# Altium schematic sheet FunctionalSchematic.SchDoc: DSP
size A3; Organization: Institut d'Automatisation Industrielle; SheetNumber: 2; SheetTotal: 3; SVN: OUI; CurrentTime: 6; CurrentDate: 5; DocumentFullPathAndName: 8; DocumentName: 9; ModifiedDate: 13; ProjectName: <projet>
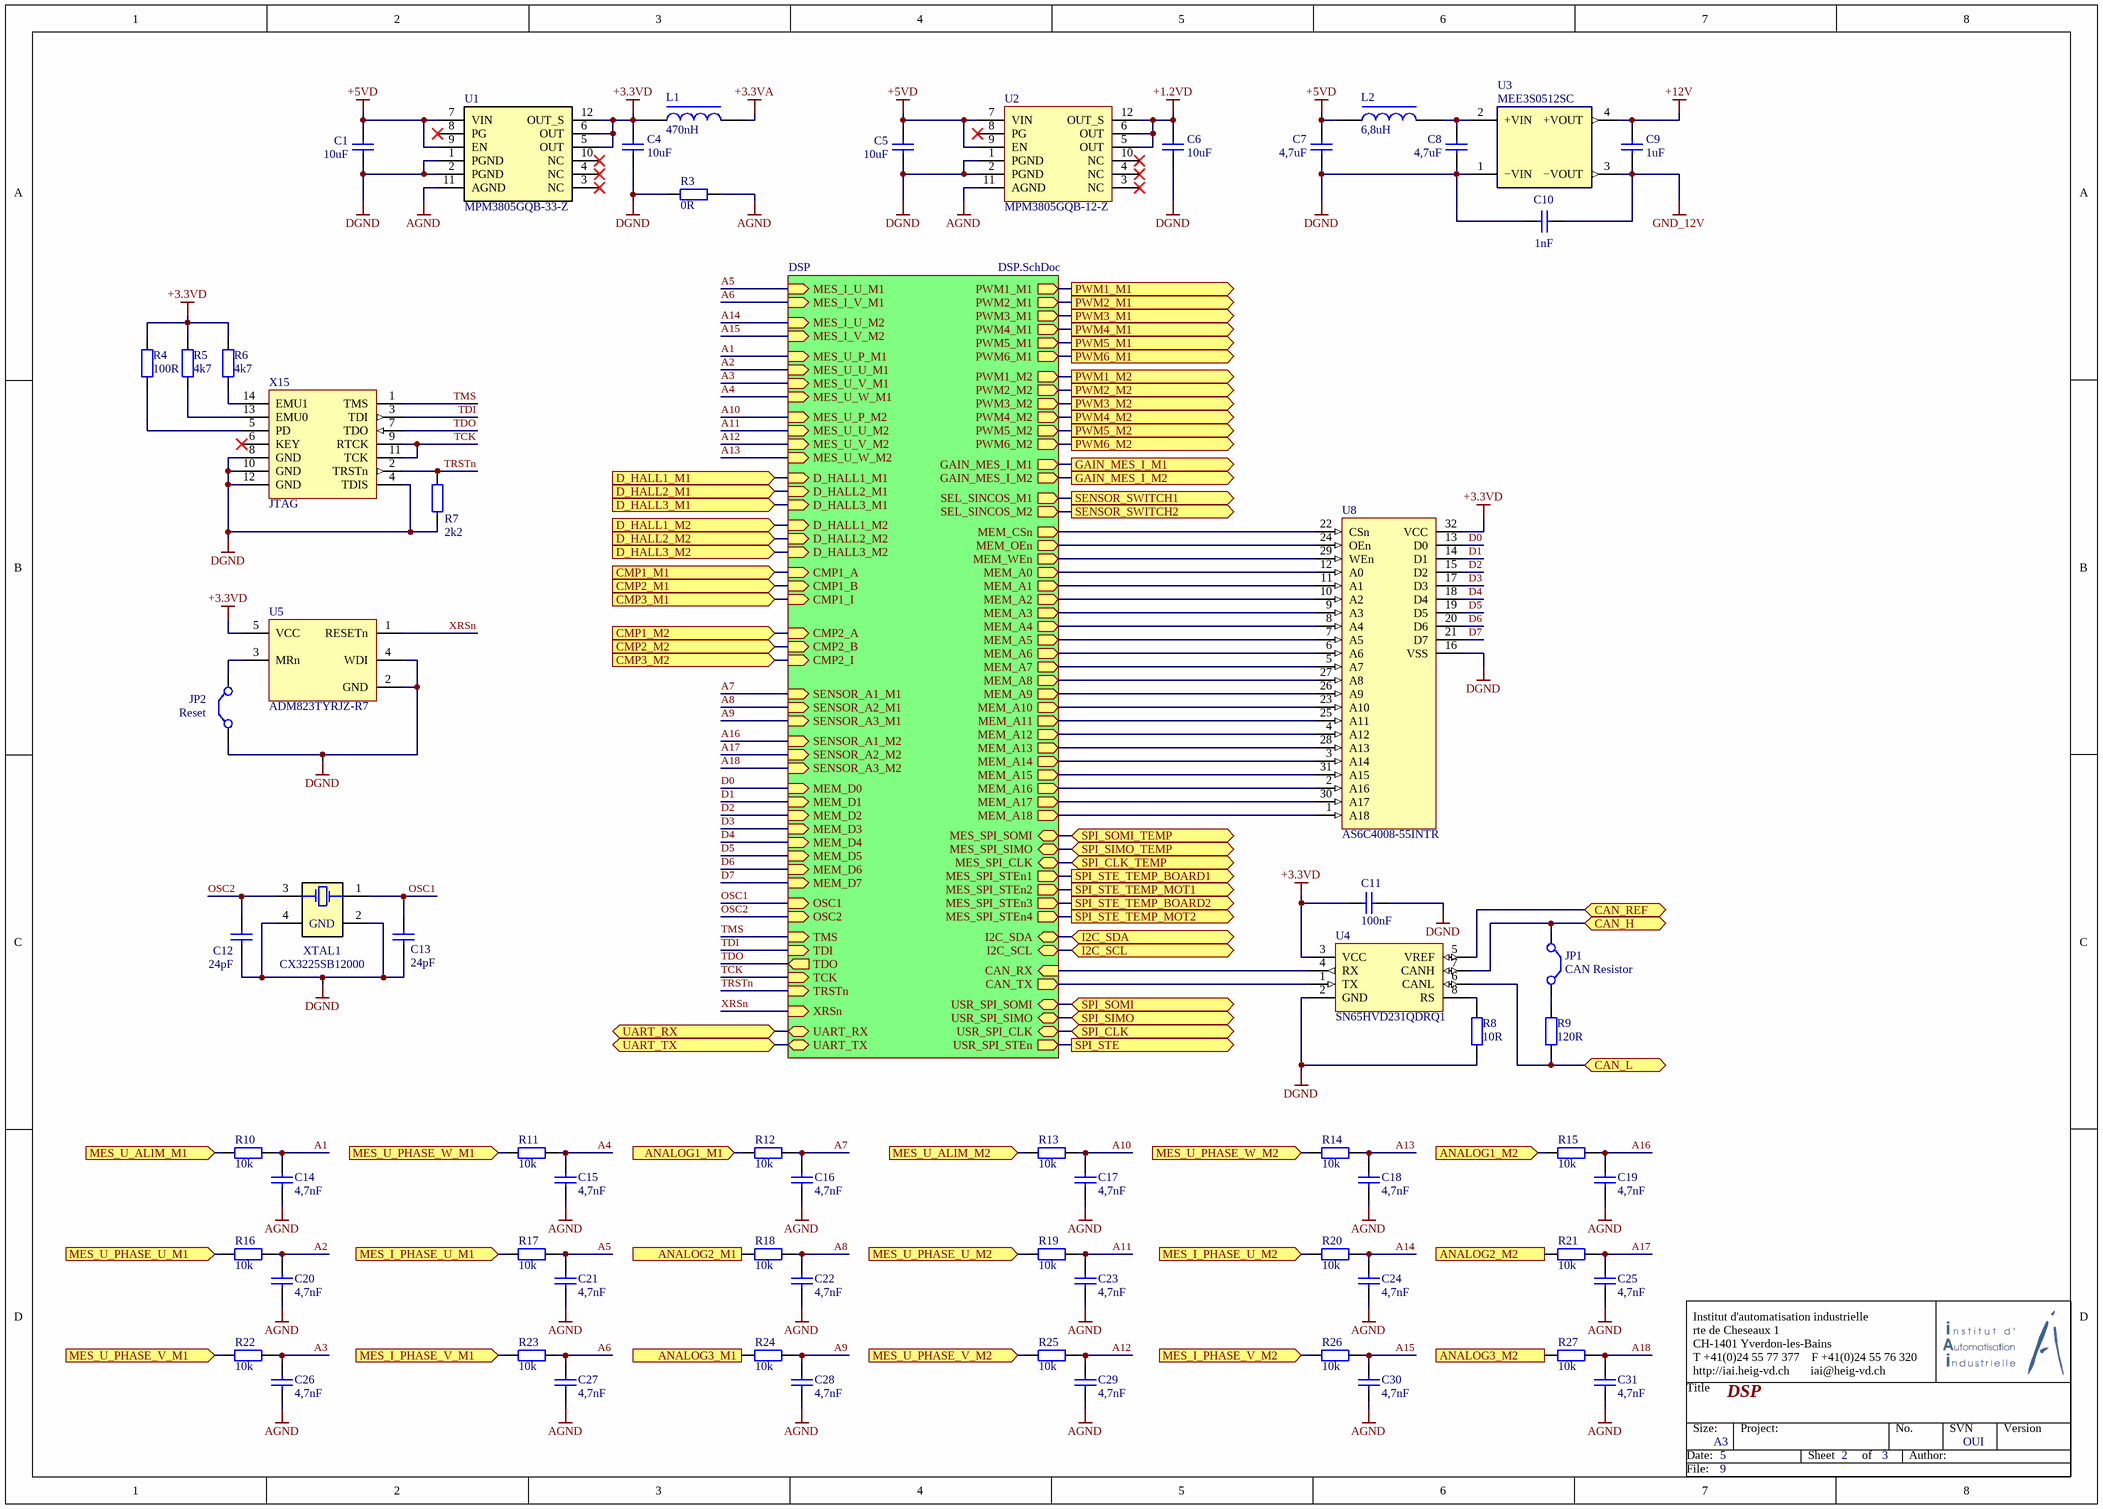
[diagram p0: FunctionalSchematic.SchDoc]

## Parts
C1  value 10uF  [CAPC1608X08N]  (hidden comment: CAP CER 10uF 0603)
C4  value 10uF  [CAPC1608X08N]  (hidden comment: CAP CER 10uF 0603)
C5  value 10uF  [CAPC1608X08N]  (hidden comment: CAP CER 10uF 0603)
C6  value 10uF  [CAPC1608X08N]  (hidden comment: CAP CER 10uF 0603)
C7  value 4,7uF  [CAPC1608X08N]  (hidden comment: CAP CER 4.7uF 0603)
C8  value 4,7uF  [CAPC1608X08N]  (hidden comment: CAP CER 4.7uF 0603)
C9  value 1uF  [CAPC1608X08N]  (hidden comment: CAP CER 1uF 0603)
C10  value 1nF  [CAPC1608X08N]  (hidden comment: CAP CER 1nF 0603)
C11  value 100nF  [CAPC1608X08N]  (hidden comment: CAP CER 100nF 0603)
C12  value 24pF  [CAPC1608X08N]  (hidden comment: CAP CER 1nF 0603)
C13  value 24pF  [CAPC1608X08N]  (hidden comment: CAP CER 1nF 0603)
C14  value 4,7nF  [CAPC1608X08N]  (hidden comment: CAP CER 4.7nF 0603)
C15  value 4,7nF  [CAPC1608X08N]  (hidden comment: CAP CER 4.7nF 0603)
C16  value 4,7nF  [CAPC1608X08N]  (hidden comment: CAP CER 4.7nF 0603)
C17  value 4,7nF  [CAPC1608X08N]  (hidden comment: CAP CER 4.7nF 0603)
C18  value 4,7nF  [CAPC1608X08N]  (hidden comment: CAP CER 4.7nF 0603)
C19  value 4,7nF  [CAPC1608X08N]  (hidden comment: CAP CER 4.7nF 0603)
C20  value 4,7nF  [CAPC1608X08N]  (hidden comment: CAP CER 4.7nF 0603)
C21  value 4,7nF  [CAPC1608X08N]  (hidden comment: CAP CER 4.7nF 0603)
C22  value 4,7nF  [CAPC1608X08N]  (hidden comment: CAP CER 4.7nF 0603)
C23  value 4,7nF  [CAPC1608X08N]  (hidden comment: CAP CER 4.7nF 0603)
C24  value 4,7nF  [CAPC1608X08N]  (hidden comment: CAP CER 4.7nF 0603)
C25  value 4,7nF  [CAPC1608X08N]  (hidden comment: CAP CER 4.7nF 0603)
C26  value 4,7nF  [CAPC1608X08N]  (hidden comment: CAP CER 4.7nF 0603)
C27  value 4,7nF  [CAPC1608X08N]  (hidden comment: CAP CER 4.7nF 0603)
C28  value 4,7nF  [CAPC1608X08N]  (hidden comment: CAP CER 4.7nF 0603)
C29  value 4,7nF  [CAPC1608X08N]  (hidden comment: CAP CER 4.7nF 0603)
C30  value 4,7nF  [CAPC1608X08N]  (hidden comment: CAP CER 4.7nF 0603)
C31  value 4,7nF  [CAPC1608X08N]  (hidden comment: CAP CER 4.7nF 0603)
JP1  Use: CAN Resistor  [62000211121]  (hidden comment: CONNECT 2pos 90°)
JP2  Use: Reset  [62000211121]  (hidden comment: CONNECT 2pos 90°)
L1  value 470nH  [INDC2016X10N]  (hidden comment: IND SMD 470nH 0806)
L2  value 6,8uH  [INDC1608X10N]  (hidden comment: IND SMD 0603)
R3  value 0R  [RESC1508X04N]  (hidden comment: RES SMD 0R 0603)
R4  value 100R  [RESC1508X04N]  (hidden comment: RES SMD 100R 0603)
R5  value 4k7  [RESC1508X04N]  (hidden comment: RES SMD 4.7k 0603)
R6  value 4k7  [RESC1508X04N]  (hidden comment: RES SMD 4.7k 0603)
R7  value 2k2  [RESC1508X04N]  (hidden comment: RES SMD 2K2 0603)
R8  value 10R  [RESC1508X04N]  (hidden comment: RES SMD 10R 0603)
R9  value 120R  [RESC1508X04N]  (hidden comment: RES SMD 120R 0603)
R10  value 10k  [RESC1508X04N]  (hidden comment: RES 10K SMD 0603)
R11  value 10k  [RESC1508X04N]  (hidden comment: RES 10K SMD 0603)
R12  value 10k  [RESC1508X04N]  (hidden comment: RES 10K SMD 0603)
R13  value 10k  [RESC1508X04N]  (hidden comment: RES 10K SMD 0603)
R14  value 10k  [RESC1508X04N]  (hidden comment: RES 10K SMD 0603)
R15  value 10k  [RESC1508X04N]  (hidden comment: RES 10K SMD 0603)
R16  value 10k  [RESC1508X04N]  (hidden comment: RES 10K SMD 0603)
R17  value 10k  [RESC1508X04N]  (hidden comment: RES 10K SMD 0603)
R18  value 10k  [RESC1508X04N]  (hidden comment: RES 10K SMD 0603)
R19  value 10k  [RESC1508X04N]  (hidden comment: RES 10K SMD 0603)
R20  value 10k  [RESC1508X04N]  (hidden comment: RES 10K SMD 0603)
R21  value 10k  [RESC1508X04N]  (hidden comment: RES 10K SMD 0603)
R22  value 10k  [RESC1508X04N]  (hidden comment: RES 10K SMD 0603)
R23  value 10k  [RESC1508X04N]  (hidden comment: RES 10K SMD 0603)
R24  value 10k  [RESC1508X04N]  (hidden comment: RES 10K SMD 0603)
R25  value 10k  [RESC1508X04N]  (hidden comment: RES 10K SMD 0603)
R26  value 10k  [RESC1508X04N]  (hidden comment: RES 10K SMD 0603)
R27  value 10k  [RESC1508X04N]  (hidden comment: RES 10K SMD 0603)
U1  value MPM3805GQB-33-Z  [QFN2p5x3p0x0p9_MNP]  (hidden comment: DC DC CONVERTER 5V-3.3V)
U2  value MPM3805GQB-12-Z  [QFN2p5x3p0x0p9_MNP]  (hidden comment: DC DC CONVERTER 5V-1.2V)
U3  value MEE3S0512SC  [DCDC CONVERTER]  (hidden comment: DC DC CONVERTER 5V-12V)
U4  value SN65HVD231QDRQ1  [SOIC127P600X175-8N]  (hidden comment: IC TRANSCEIVER CAN)
U5  value ADM823TYRJZ-R7  [SOT95P280X145-5N]  (hidden comment: SUPERVISOR 1 CHANNEL)
U8  value AS6C4008-55INTR  [SOP127P1410X300-32N]  (hidden comment: RAM SPI)
X15  Use: JTAG  [62101421021]  (hidden comment: CONNECT SMD 7x2pos 180°)
XTAL1  value CX3225SB12000  [OSCCC320X250X60N]  (hidden comment: CRYSTAL 12.0000MHZ)

## Sub-sheets
DSP = DSP.SchDoc: MEM_A11 (out), MES_U_U_M2 (in), MEM_A18 (out), SEL_SINCOS_M2 (out), MES_U_P_M2 (in), MEM_D1 (in), SENSOR_A3_M1 (in), D_HALL3_M1 (in), D_HALL3_M2 (in), MES_SPI_STEn1 (out), SENSOR_A3_M2 (in), MES_SPI_STEn3 (out), MES_I_U_M2 (in), MEM_D0 (in), CMP1_I (in), MEM_D4 (in), CMP2_I (in), MES_SPI_STEn2 (out), CMP2_B (in), MEM_D5 (in), MEM_D6 (in), MES_SPI_STEn4 (out), MEM_A15 (out), CMP1_A (in), MES_I_V_M1 (in), MEM_D2 (in), OSC2 (in), TDI (in), SEL_SINCOS_M1 (out), MES_U_P_M1 (in), SENSOR_A2_M1 (in), XRSn (in), SENSOR_A1_M1 (in), SENSOR_A2_M2 (in), MEM_D7 (in), MES_U_V_M2 (in), D_HALL2_M2 (in), MEM_A16 (out), OSC1 (in), MES_I_V_M2 (in), MEM_A7 (out), MEM_A14 (out), MEM_D3 (in), MEM_A10 (out), MEM_A9 (out), TMS (in), MES_U_V_M1 (in), GAIN_MES_I_M1 (out), MEM_A12 (out), TRSTn (in), D_HALL1_M1 (in), MEM_A6 (out), MEM_A17 (out), CMP1_B (in), MES_U_W_M1 (in), SENSOR_A1_M2 (in), MES_U_U_M1 (in), D_HALL2_M1 (in), TCK (in), D_HALL1_M2 (in), MES_U_W_M2 (in), MEM_A13 (out), TDO (out), MES_I_U_M1 (in), MEM_CSn (out), MEM_A8 (out), CMP2_A (in), GAIN_MES_I_M2 (out), MEM_A2 (out), PWM5_M1 (out), MEM_A0 (out), PWM6_M1 (out), MEM_OEn (out), MES_SPI_CLK (bidir), USR_SPI_CLK (bidir), PWM2_M1 (out), PWM5_M2 (out), UART_TX (bidir), MES_SPI_SOMI (bidir), PWM6_M2 (out), PWM1_M2 (out), USR_SPI_SIMO (bidir), PWM3_M1 (out), I2C_SCL (bidir), USR_SPI_SOMI (bidir), MEM_A5 (out), PWM3_M2 (out), I2C_SDA (bidir), MEM_A4 (out), MEM_WEn (out), UART_RX (bidir), PWM4_M2 (out), CAN_RX (in), USR_SPI_STEn (out), CAN_TX (out), PWM4_M1 (out), PWM1_M1 (out), MES_SPI_SIMO (bidir), MEM_A3 (out), MEM_A1 (out), PWM2_M2 (out)

## Ports
ANALOG1_M1 (in), ANALOG1_M2 (in), ANALOG2_M1 (in), ANALOG2_M2 (in), ANALOG3_M1 (in), ANALOG3_M2 (in), CAN_H (bidir), CAN_L (bidir), CAN_REF (bidir), CMP1_M1 (in), CMP1_M2 (in), CMP2_M1 (in), CMP2_M2 (in), CMP3_M1 (in), CMP3_M2 (in), D_HALL1_M1 (in), D_HALL1_M2 (in), D_HALL2_M1 (in), D_HALL2_M2 (in), D_HALL3_M1 (in), D_HALL3_M2 (in), GAIN_MES_I_M1 (out), GAIN_MES_I_M2 (out), I2C_SCL (bidir), I2C_SDA (bidir), MES_I_PHASE_U_M1 (in), MES_I_PHASE_U_M2 (in), MES_I_PHASE_V_M1 (in), MES_I_PHASE_V_M2 (in), MES_U_ALIM_M1 (in), MES_U_ALIM_M2 (in), MES_U_PHASE_U_M1 (in), MES_U_PHASE_U_M2 (in), MES_U_PHASE_V_M1 (in), MES_U_PHASE_V_M2 (in), MES_U_PHASE_W_M1 (in), MES_U_PHASE_W_M2 (in), PWM1_M1 (out), PWM1_M2 (out), PWM2_M1 (out), PWM2_M2 (out), PWM3_M1 (out), PWM3_M2 (out), PWM4_M1 (out), PWM4_M2 (out), PWM5_M1 (out), PWM5_M2 (out), PWM6_M1 (out), PWM6_M2 (out), SENSOR_SWITCH1 (out), SENSOR_SWITCH2 (out), SPI_CLK (bidir), SPI_CLK_TEMP (bidir), SPI_SIMO (bidir), SPI_SIMO_TEMP (bidir), SPI_SOMI (bidir), SPI_SOMI_TEMP (bidir), SPI_STE (out), SPI_STE_TEMP_BOARD1 (out), SPI_STE_TEMP_BOARD2 (out), SPI_STE_TEMP_MOT1 (out), SPI_STE_TEMP_MOT2 (out), UART_RX (bidir), UART_TX (bidir)

## Nets
+1.2VD: C6.2 U2.5(OUT) U2.6(OUT) U2.12(OUT_S)
+3.3VA: L1.2
+3.3VD: C4.2 C11.1 L1.1 R4.2 R5.2 R6.2 U1.5(OUT) U1.6(OUT) U1.12(OUT_S) U4.3(VCC) U5.5(VCC) U8.32(VCC)
+5VD: C1.2 C5.2 C7.2 L2.1 U1.7(VIN) U1.9(EN) U2.7(VIN) U2.9(EN)
+12V: C9.2 U3.4(+VOUT)
AGND: C14.1 C15.1 C16.1 C17.1 C18.1 C19.1 C20.1 C21.1 C22.1 C23.1 C24.1 C25.1 C26.1 C27.1 C28.1 C29.1 C30.1 C31.1 R3.2 U1.11(AGND) U2.11(AGND)
DGND: C1.1 C4.1 C5.1 C6.1 C7.1 C8.1 C10.1 C11.2 C12.1 C13.2 JP2.2(C2) R3.1 R7.1 R8.1 U1.1(PGND) U1.2(PGND) U2.1(PGND) U2.2(PGND) U3.1(−VIN) U4.2(GND) U5.2(GND) U5.4(WDI) U8.16(VSS) X15.4(TDIS) X15.8(GND) X15.10(GND) X15.12(GND) XTAL1.2(GND) XTAL1.4(GND)
GND_12V: C9.1 C10.2 U3.3(−VOUT)
A1: C14.2 R10.2 ; sheet DSP/MES_U_P_M1
A2: C20.2 R16.2 ; sheet DSP/MES_U_U_M1
A3: C26.2 R22.2 ; sheet DSP/MES_U_V_M1
A4: C15.2 R11.2 ; sheet DSP/MES_U_W_M1
A5: C21.2 R17.2 ; sheet DSP/MES_I_U_M1
A6: C27.2 R23.2 ; sheet DSP/MES_I_V_M1
A7: C16.2 R12.2 ; sheet DSP/SENSOR_A1_M1
A8: C22.2 R18.2 ; sheet DSP/SENSOR_A2_M1
A9: C28.2 R24.2 ; sheet DSP/SENSOR_A3_M1
A10: C17.2 R13.2 ; sheet DSP/MES_U_P_M2
A11: C23.2 R19.2 ; sheet DSP/MES_U_U_M2
A12: C29.2 R25.2 ; sheet DSP/MES_U_V_M2
A13: C18.2 R14.2 ; sheet DSP/MES_U_W_M2
A14: C24.2 R20.2 ; sheet DSP/MES_I_U_M2
A15: C30.2 R26.2 ; sheet DSP/MES_I_V_M2
A16: C19.2 R15.2 ; sheet DSP/SENSOR_A1_M2
A17: C25.2 R21.2 ; sheet DSP/SENSOR_A2_M2
A18: C31.2 R27.2 ; sheet DSP/SENSOR_A3_M2
ANALOG1_M1: R12.1 ; port ANALOG1_M1
ANALOG1_M2: R15.1 ; port ANALOG1_M2
ANALOG2_M1: R18.1 ; port ANALOG2_M1
ANALOG2_M2: R21.1 ; port ANALOG2_M2
ANALOG3_M1: R24.1 ; port ANALOG3_M1
ANALOG3_M2: R27.1 ; port ANALOG3_M2
CAN_H: JP1.1(C1) U4.7(CANH) ; port CAN_H
CAN_L: R9.1 U4.6(CANL) ; port CAN_L
CAN_REF: U4.5(VREF) ; port CAN_REF
CMP1_M1: port CMP1_M1, sheet DSP/CMP1_A
CMP1_M2: port CMP1_M2, sheet DSP/CMP2_A
CMP2_M1: port CMP2_M1, sheet DSP/CMP1_B
CMP2_M2: port CMP2_M2, sheet DSP/CMP2_B
CMP3_M1: port CMP3_M1, sheet DSP/CMP1_I
CMP3_M2: port CMP3_M2, sheet DSP/CMP2_I
D0: U8.13(D0) ; sheet DSP/MEM_D0
D1: U8.14(D1) ; sheet DSP/MEM_D1
D2: U8.15(D2) ; sheet DSP/MEM_D2
D3: U8.17(D3) ; sheet DSP/MEM_D3
D4: U8.18(D4) ; sheet DSP/MEM_D4
D5: U8.19(D5) ; sheet DSP/MEM_D5
D6: U8.20(D6) ; sheet DSP/MEM_D6
D7: U8.21(D7) ; sheet DSP/MEM_D7
D_HALL1_M1: port D_HALL1_M1, sheet DSP/D_HALL1_M1
D_HALL1_M2: port D_HALL1_M2, sheet DSP/D_HALL1_M2
D_HALL2_M1: port D_HALL2_M1, sheet DSP/D_HALL2_M1
D_HALL2_M2: port D_HALL2_M2, sheet DSP/D_HALL2_M2
D_HALL3_M1: port D_HALL3_M1, sheet DSP/D_HALL3_M1
D_HALL3_M2: port D_HALL3_M2, sheet DSP/D_HALL3_M2
GAIN_MES_I_M1: port GAIN_MES_I_M1, sheet DSP/GAIN_MES_I_M1
GAIN_MES_I_M2: port GAIN_MES_I_M2, sheet DSP/GAIN_MES_I_M2
I2C_SCL: port I2C_SCL, sheet DSP/I2C_SCL
I2C_SDA: port I2C_SDA, sheet DSP/I2C_SDA
MES_I_PHASE_U_M1: R17.1 ; port MES_I_PHASE_U_M1
MES_I_PHASE_U_M2: R20.1 ; port MES_I_PHASE_U_M2
MES_I_PHASE_V_M1: R23.1 ; port MES_I_PHASE_V_M1
MES_I_PHASE_V_M2: R26.1 ; port MES_I_PHASE_V_M2
MES_U_ALIM_M1: R10.1 ; port MES_U_ALIM_M1
MES_U_ALIM_M2: R13.1 ; port MES_U_ALIM_M2
MES_U_PHASE_U_M1: R16.1 ; port MES_U_PHASE_U_M1
MES_U_PHASE_U_M2: R19.1 ; port MES_U_PHASE_U_M2
MES_U_PHASE_V_M1: R22.1 ; port MES_U_PHASE_V_M1
MES_U_PHASE_V_M2: R25.1 ; port MES_U_PHASE_V_M2
MES_U_PHASE_W_M1: R11.1 ; port MES_U_PHASE_W_M1
MES_U_PHASE_W_M2: R14.1 ; port MES_U_PHASE_W_M2
OSC1: C13.1 XTAL1.1(OSC1) ; sheet DSP/OSC1
OSC2: C12.2 XTAL1.3(OSC2) ; sheet DSP/OSC2
PWM1_M1: port PWM1_M1, sheet DSP/PWM1_M1
PWM1_M2: port PWM1_M2, sheet DSP/PWM1_M2
PWM2_M1: port PWM2_M1, sheet DSP/PWM2_M1
PWM2_M2: port PWM2_M2, sheet DSP/PWM2_M2
PWM3_M1: port PWM3_M1, sheet DSP/PWM3_M1
PWM3_M2: port PWM3_M2, sheet DSP/PWM3_M2
PWM4_M1: port PWM4_M1, sheet DSP/PWM4_M1
PWM4_M2: port PWM4_M2, sheet DSP/PWM4_M2
PWM5_M1: port PWM5_M1, sheet DSP/PWM5_M1
PWM5_M2: port PWM5_M2, sheet DSP/PWM5_M2
PWM6_M1: port PWM6_M1, sheet DSP/PWM6_M1
PWM6_M2: port PWM6_M2, sheet DSP/PWM6_M2
SENSOR_SWITCH1: port SENSOR_SWITCH1, sheet DSP/SEL_SINCOS_M1
SENSOR_SWITCH2: port SENSOR_SWITCH2, sheet DSP/SEL_SINCOS_M2
SPI_CLK: port SPI_CLK, sheet DSP/USR_SPI_CLK
SPI_CLK_TEMP: port SPI_CLK_TEMP, sheet DSP/MES_SPI_CLK
SPI_SIMO: port SPI_SIMO, sheet DSP/USR_SPI_SIMO
SPI_SIMO_TEMP: port SPI_SIMO_TEMP, sheet DSP/MES_SPI_SIMO
SPI_SOMI: port SPI_SOMI, sheet DSP/USR_SPI_SOMI
SPI_SOMI_TEMP: port SPI_SOMI_TEMP, sheet DSP/MES_SPI_SOMI
SPI_STE: port SPI_STE, sheet DSP/USR_SPI_STEn
SPI_STE_TEMP_BOARD1: port SPI_STE_TEMP_BOARD1, sheet DSP/MES_SPI_STEn1
SPI_STE_TEMP_BOARD2: port SPI_STE_TEMP_BOARD2, sheet DSP/MES_SPI_STEn3
SPI_STE_TEMP_MOT1: port SPI_STE_TEMP_MOT1, sheet DSP/MES_SPI_STEn2
SPI_STE_TEMP_MOT2: port SPI_STE_TEMP_MOT2, sheet DSP/MES_SPI_STEn4
TCK: X15.9(RTCK) X15.11(TCK) ; sheet DSP/TCK
TDI: X15.3(TDI) ; sheet DSP/TDI
TDO: X15.7(TDO) ; sheet DSP/TDO
TMS: X15.1(TMS) ; sheet DSP/TMS
TRSTn: R7.2 X15.2(TRSTn) ; sheet DSP/TRSTn
UART_RX: port UART_RX, sheet DSP/UART_RX
UART_TX: port UART_TX, sheet DSP/UART_TX
XRSn: U5.1(RESETn) ; sheet DSP/XRSn
NetC8_2: C8.2 L2.2 U3.2(+VIN)
NetJP1_2: JP1.2(C2) R9.2
NetJP2_1: JP2.1(C1) U5.3(MRn)
NetR4_1: R4.1 X15.5(PD)
NetR5_1: R5.1 X15.13(EMU0)
NetR6_1: R6.1 X15.14(EMU1)
NetR8_2: R8.2 U4.8(RS)
NetU4_1: U4.1(TX) ; sheet DSP/CAN_TX
NetU4_4: U4.4(RX) ; sheet DSP/CAN_RX
NetU8_1: U8.1(A18) ; sheet DSP/MEM_A18
NetU8_2: U8.2(A16) ; sheet DSP/MEM_A16
NetU8_3: U8.3(A14) ; sheet DSP/MEM_A14
NetU8_4: U8.4(A12) ; sheet DSP/MEM_A12
NetU8_5: U8.5(A7) ; sheet DSP/MEM_A7
NetU8_6: U8.6(A6) ; sheet DSP/MEM_A6
NetU8_7: U8.7(A5) ; sheet DSP/MEM_A5
NetU8_8: U8.8(A4) ; sheet DSP/MEM_A4
NetU8_9: U8.9(A3) ; sheet DSP/MEM_A3
NetU8_10: U8.10(A2) ; sheet DSP/MEM_A2
NetU8_11: U8.11(A1) ; sheet DSP/MEM_A1
NetU8_12: U8.12(A0) ; sheet DSP/MEM_A0
NetU8_22: U8.22(CSn) ; sheet DSP/MEM_CSn
NetU8_23: U8.23(A10) ; sheet DSP/MEM_A10
NetU8_24: U8.24(OEn) ; sheet DSP/MEM_OEn
NetU8_25: U8.25(A11) ; sheet DSP/MEM_A11
NetU8_26: U8.26(A9) ; sheet DSP/MEM_A9
NetU8_27: U8.27(A8) ; sheet DSP/MEM_A8
NetU8_28: U8.28(A13) ; sheet DSP/MEM_A13
NetU8_29: U8.29(WEn) ; sheet DSP/MEM_WEn
NetU8_30: U8.30(A17) ; sheet DSP/MEM_A17
NetU8_31: U8.31(A15) ; sheet DSP/MEM_A15

Not connected (* = marked no-connect by the designer): U1 3(NC)* 4(NC)* 8(PG)* 10(NC)*; U2 3(NC)* 4(NC)* 8(PG)* 10(NC)*; X15 6(KEY)*

## Notes on the sheet
- Title
- Institut d'automatisation industrielle
  rte de Cheseaux 1
  CH-1401 Yverdon-les-Bains
  T +41(0)24 55 77 377    F +41(0)24 55 76 320
  http://iai.heig-vd.ch       iai@heig-vd.ch
- Date:
- Size:
- A3
- Project:
- Sheet
- of
- No.
- Author:
- SVN
- Version
- File:

## Library data of the parts
C1 C4-C6 = CAP CER 10uF 10% 10V 0603: 10µF ±20% 10V Condensateurs céramique X5R 0603 (1608 métrique); Supplier 1: Digi-Key; Supplier Part Number 1: 399-14945-1-ND
C7 C8 = CAP CER 4.7uF 10% 10V 0603: 4,7µF ±20% 10V Condensateurs céramique X5R 0603 (1608 métrique); Supplier 1: Digi-Key; Supplier Part Number 1: 399-9100-1-ND
C9 = CAP CER 1uF 10% 16V 0603: 1µF ±10% 16V Condensateurs céramique X7R 0603 (1608 métrique); Supplier 1: Digi-Key; Supplier Part Number 1: 399-7847-1-ND
C10 = CAP CER 1nF 10% 10V 0603: 1nF ±10% 10V Condensateurs céramique X7R 0603 (1608 métrique); Supplier 1: Digi-Key; Supplier Part Number 1: 399-8984-1-ND
C11 = CAP CER 100nF 10% 10V 0603: 0,1µF ±10% 10V Condensateurs céramique X7R 0603 (1608 métrique); Supplier 1: Digi-Key; Supplier Part Number 1: 399-1095-1-ND
C12 C13 = CAP CER 24pF 10% 10V 0603: 24pF ±10% 10V Condensateurs céramique X7R 0603 (1608 métrique); Supplier 1: Digi-Key; Supplier Part Number 1: 399-8984-1-ND
C14-C31 = CAP CER 4.7nF 10% 10V 0603: 4,7nF ±10% 10V Condensateurs céramique X7R 0603 (1608 métrique); Supplier 1: Digi-Key; Supplier Part Number 1: 399-9092-1-ND
JP1 JP2 = CONNECT 2pos 90° 3.81mm: 2 Positions, bloc de jonction Embase, broche mâle, gainée (4 côtés) 0,150 po (3,81mm) 90°, engle droit Trou traversant; Value: WR-TBL322; Supplier 1: Digi-Key; Supplier Part Number 1: 732-2088-ND
L2 = IND SMD 6.8uH 0603: 6,8µH Blindé Multicouche Inducteur 15mA 1,3Ohms maxi 0603 (1608 métrique); Supplier 1: Digi-Key; Supplier Part Number 1: 445-173923-1-ND
R3 = RES SMD 0 OHM 1% 1/10W 0603: Resistance 0 OHM
R4 = RES SMD 100 OHM 1% 1/10W 0603: 100 Ohms ±1% 0,1W, 1/10W Pavé résistif 0603 (1608 métrique) AutomobileAEC-Q200 Couche épaisse; Supplier 1: Digi-Key; Supplier Part Number 1: RMCF0603FT100RCT-ND
R5 R6 = RES SMD 4.7k OHM 1% 1/10W 0603: 4,7 kOhms ±1% 0,1W, 1/10W Pavé résistif 0603 (1608 métrique) AutomobileAEC-Q200 Couche épaisse; Supplier 1: Digi-Key; Supplier Part Number 1: RMCF0603FT4K70CT-ND
R7 = RES SMD 2K2 OHM 1% 1/10W 0603: 2,2 kOhms ±1% 0,1W, 1/10W Pavé résistif 0603 (1608 métrique) AutomobileAEC-Q200 Couche épaisse; Supplier 1: Digi-Key; Supplier Part Number 1: RMCF0603FT2K20CT-ND
R8 = RES SMD 10 OHM 1% 1/10W 0603: 10 Ohms ±1% 0,1W, 1/10W Pavé résistif 0603 (1608 métrique) AutomobileAEC-Q200 Couche épaisse; Supplier 1: Digi-Key; Supplier Part Number 1: RMCF0603FT10R0CT-ND
R9 = RES SMD 120 OHM 1% 1/10W 0603: 120 Ohms ±1% 0,1W, 1/10W Pavé résistif 0603 (1608 métrique) AutomobileAEC-Q200 Couche épaisse; Supplier 1: Digi-Key; Supplier Part Number 1: RMCF0603FT120RCT-ND
R10-R27 = RES SMD 10K OHM 1% 1/10W 0603: 10 kOhms ±1% 0,1W, 1/10W Pavé résistif 0603 (1608 métrique) AutomobileAEC-Q200 Couche épaisse; Supplier 1: Digi-Key; Supplier Part Number 1: RMCF0603FT10K0CT-ND
U1 = DC DC CONVERTER 5V-3.3V 2W: Module PoL non isolé Convertisseurs CC/CC 1 Sortie 3,3V 600mA 2,5V - 6V Entrée; Supplier 1: Digi-Key; Supplier Part Number 1: 1589-1986-1-ND
U2 = DC DC CONVERTER 5V-1.2V 720mW: Module PoL non isolé Convertisseurs CC/CC 1 Sortie 1,2V 600mA 2,5V - 6V Entrée /; Supplier 1: Digi-Key; Supplier Part Number 1: 1589-1983-1-ND
U3 = DC DC CONVERTER 5V-12V 3W: Module isolé Convertisseurs CC/CC 1 Sortie 12V 250mA 4,5V - 5,5V Entrée; Supplier 1: Digi-Key; Supplier Part Number 1: 811-2358-5-ND
U4 = IC TRANSCEIVER HALF 1/1 8SOIC: Émetteur-récepteur 1/1 Semi CANbus 8-SOIC; Supplier 1: Digi-Key; Supplier Part Number 1: 296-15380-1-ND
U5 = IC SUPERVISOR 1 CHANNEL SOT23-5: Superviseur Pousser-tirer/Totem pôle 1 canal SOT-23-5; Supplier 1: Digi-Key; Supplier Part Number 1: ADM823TYRJZ-R7CT-ND
U8 = RAM: IC RAM 8MBIT SPI 10MHZ 8SOP
X15 = CONNECT SMD 7x2pos 180° 2.54mm: Value: *
XTAL1 = OSCILLATOR 12MHz: CRYSTAL 12.0000MHZ 8PF SMD